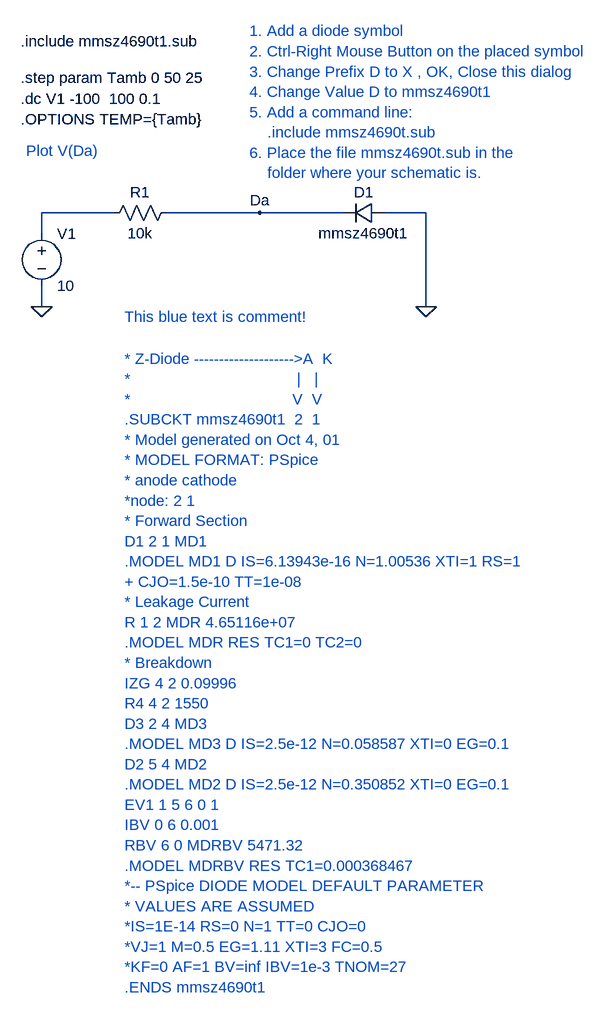
[diagram p0: schematic zdiode_x.asc]
zdiode_x.asc, the LTspice schematic file:
Version 4
SHEET 1 1000 1060
WIRE 64 -64 64 -96
WIRE 64 48 64 16
WIRE 176 -96 64 -96
WIRE 400 -96 256 -96
WIRE 528 -96 400 -96
WIRE 656 -96 592 -96
WIRE 656 48 656 -96
FLAG 656 48 0
FLAG 64 48 0
FLAG 400 -96 Da
SYMBOL diode 592 -112 R90
WINDOW 0 0 32 VBottom 0
WINDOW 3 32 32 VTop 0
SYMATTR InstName D1
SYMATTR Value mmsz4690t1
SYMATTR Prefix X
SYMBOL res 160 -80 R270
WINDOW 0 32 56 VTop 0
WINDOW 3 0 56 VBottom 0
SYMATTR InstName R1
SYMATTR Value 10k
SYMBOL voltage 64 -80 R0
SYMATTR InstName V1
SYMATTR Value 10
TEXT 192 128 Left 0 ;* Z-Diode -------------------->A  K\n*                                     |   |\n*                                    V  V\n.SUBCKT mmsz4690t1  2  1\n* Model generated on Oct 4, 01\n* MODEL FORMAT: PSpice\n* anode cathode\n*node: 2 1\n* Forward Section\nD1 2 1 MD1\n.MODEL MD1 D IS=6.13943e-16 N=1.00536 XTI=1 RS=1\n+ CJO=1.5e-10 TT=1e-08\n* Leakage Current\nR 1 2 MDR 4.65116e+07 \n.MODEL MDR RES TC1=0 TC2=0\n* Breakdown\nIZG 4 2 0.09996\nR4 4 2 1550\nD3 2 4 MD3\n.MODEL MD3 D IS=2.5e-12 N=0.058587 XTI=0 EG=0.1\nD2 5 4 MD2\n.MODEL MD2 D IS=2.5e-12 N=0.350852 XTI=0 EG=0.1\nEV1 1 5 6 0 1\nIBV 0 6 0.001\nRBV 6 0 MDRBV 5471.32\n.MODEL MDRBV RES TC1=0.000368467\n*-- PSpice DIODE MODEL DEFAULT PARAMETER\n* VALUES ARE ASSUMED\n*IS=1E-14 RS=0 N=1 TT=0 CJO=0\n*VJ=1 M=0.5 EG=1.11 XTI=3 FC=0.5\n*KF=0 AF=1 BV=inf IBV=1e-3 TNOM=27\n.ENDS mmsz4690t1
TEXT 32 -272 Left 0 !.dc V1 -100  100 0.1
TEXT 32 -240 Left 0 !.OPTIONS TEMP={Tamb}
TEXT 32 -304 Left 0 !.step param Tamb 0 50 25
TEXT 32 -360 Left 0 !.include mmsz4690t1.sub
TEXT 384 -376 Left 0 ;1. Add a diode symbol\n2. Ctrl-Right Mouse Button on the placed symbol\n3. Change Prefix D to X , OK, Close this dialog\n4. Change Value D to mmsz4690t1\n5. Add a command line: \n    .include mmsz4690t.sub\n6. Place the file mmsz4690t.sub in the \n    folder where your schematic is.
TEXT 192 64 Left 0 ;This blue text is comment!
TEXT 40 -192 Left 0 ;Plot V(Da)

The netlist it stands for:
* zdiode_x.asc
XD1 0 Da mmsz4690t1  ; pins + -
R1 N001 Da 10k
V1 N001 0 10
* * Z-Diode -------------------->A  K
* *                                     |   |
* *                                    V  V
* .SUBCKT mmsz4690t1  2  1
* * Model generated on Oct 4, 01
* * MODEL FORMAT: PSpice
* * anode cathode
* *node: 2 1
* * Forward Section
* D1 2 1 MD1
* .MODEL MD1 D IS=6.13943e-16 N=1.00536 XTI=1 RS=1
* + CJO=1.5e-10 TT=1e-08
* * Leakage Current
* R 1 2 MDR 4.65116e+07
* .MODEL MDR RES TC1=0 TC2=0
* * Breakdown
* IZG 4 2 0.09996
* R4 4 2 1550
* D3 2 4 MD3
* .MODEL MD3 D IS=2.5e-12 N=0.058587 XTI=0 EG=0.1
* D2 5 4 MD2
* .MODEL MD2 D IS=2.5e-12 N=0.350852 XTI=0 EG=0.1
* EV1 1 5 6 0 1
* IBV 0 6 0.001
* RBV 6 0 MDRBV 5471.32
* .MODEL MDRBV RES TC1=0.000368467
* *-- PSpice DIODE MODEL DEFAULT PARAMETER
* * VALUES ARE ASSUMED
* *IS=1E-14 RS=0 N=1 TT=0 CJO=0
* *VJ=1 M=0.5 EG=1.11 XTI=3 FC=0.5
* *KF=0 AF=1 BV=inf IBV=1e-3 TNOM=27
* .ENDS mmsz4690t1
.dc V1 -100  100 0.1
.OPTIONS TEMP={Tamb}
.step param Tamb 0 50 25
.include mmsz4690t1.sub
* 1. Add a diode symbol
* 2. Ctrl-Right Mouse Button on the placed symbol
* 3. Change Prefix D to X , OK, Close this dialog
* 4. Change Value D to mmsz4690t1
* 5. Add a command line:
*     .include mmsz4690t.sub
* 6. Place the file mmsz4690t.sub in the
*     folder where your schematic is.
* This blue text is comment!
* Plot V(Da)
.backanno
.end